# EAGLE design 8 Cell Balancing Module (EAGLE 5.12)
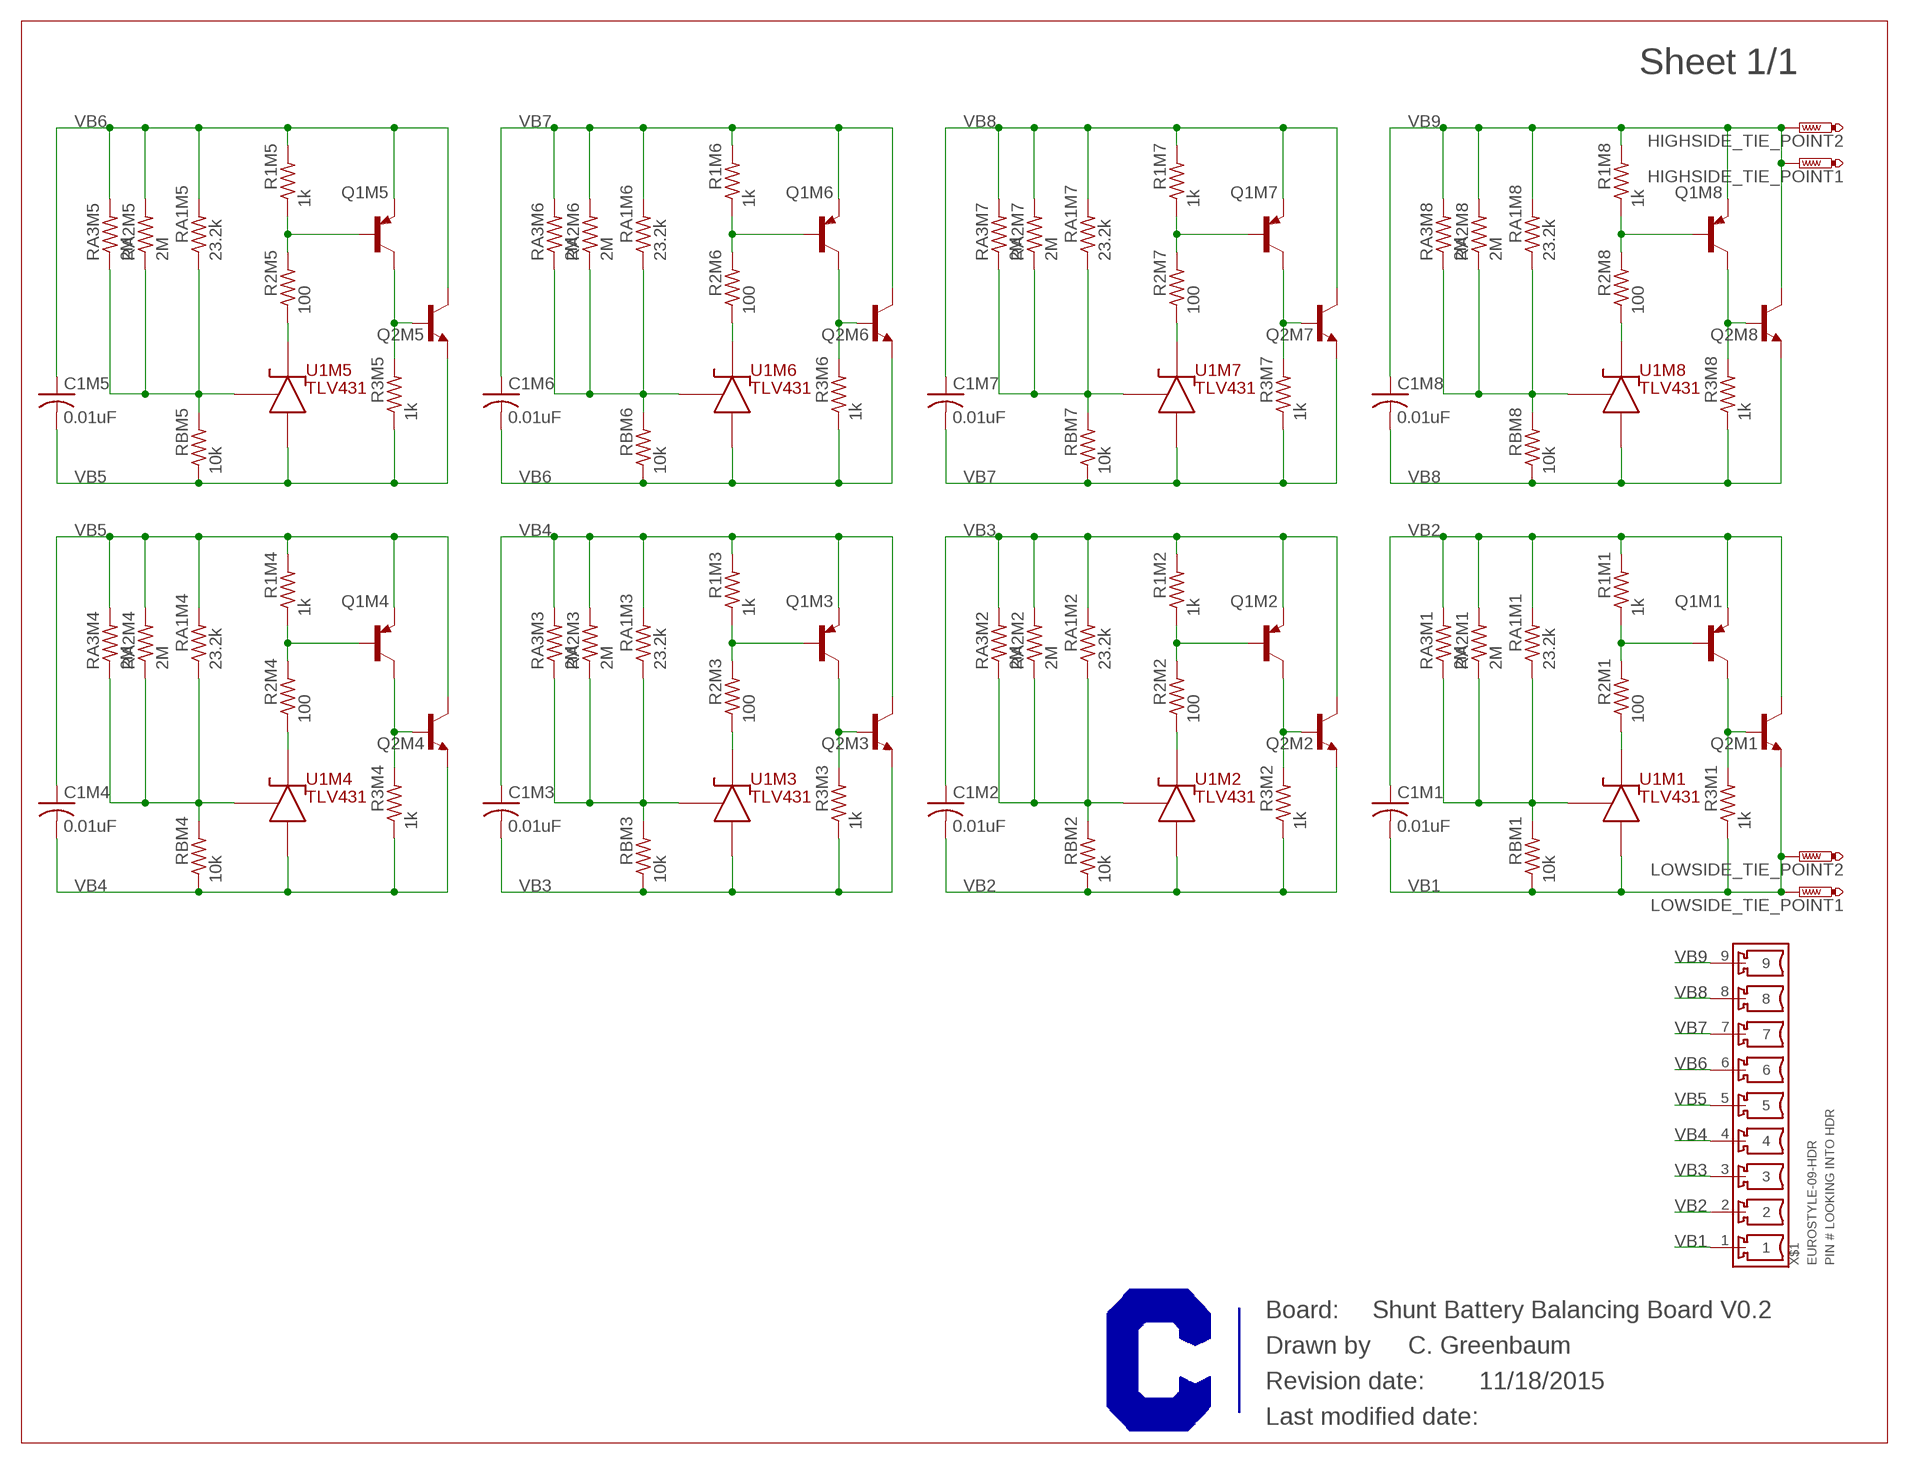
[diagram p0: schematic, sheet 1]

## Parts
C1M1  0.01uF  C-USC0603  [C0603]
C1M2  0.01uF  C-USC0603  [C0603]
C1M3  0.01uF  C-USC0603  [C0603]
C1M4  0.01uF  C-USC0603  [C0603]
C1M5  0.01uF  C-USC0603  [C0603]
C1M6  0.01uF  C-USC0603  [C0603]
C1M7  0.01uF  C-USC0603  [C0603]
C1M8  0.01uF  C-USC0603  [C0603]
HIGHSIDE_TIE_POINT1  PTR1PAD1-20Y  [P1-20Y]
HIGHSIDE_TIE_POINT2  PTR1PAD1-20Y  [P1-20Y]
LOWSIDE_TIE_POINT1  PTR1PAD1-20Y  [P1-20Y]
LOWSIDE_TIE_POINT2  PTR1PAD1-20Y  [P1-20Y]
Q1M1  MMBT3906LT1SMD  [SOT23-BEC]
Q1M2  MMBT3906LT1SMD  [SOT23-BEC]
Q1M3  MMBT3906LT1SMD  [SOT23-BEC]
Q1M4  MMBT3906LT1SMD  [SOT23-BEC]
Q1M5  MMBT3906LT1SMD  [SOT23-BEC]
Q1M6  MMBT3906LT1SMD  [SOT23-BEC]
Q1M7  MMBT3906LT1SMD  [SOT23-BEC]
Q1M8  MMBT3906LT1SMD  [SOT23-BEC]
Q2M1  D44VH10  -NPN-TO220V  [TO220V]
Q2M2  D44VH10  -NPN-TO220V  [TO220V]
Q2M3  D44VH10  -NPN-TO220V  [TO220V]
Q2M4  D44VH10  -NPN-TO220V  [TO220V]
Q2M5  D44VH10  -NPN-TO220V  [TO220V]
Q2M6  D44VH10  -NPN-TO220V  [TO220V]
Q2M7  D44VH10  -NPN-TO220V  [TO220V]
Q2M8  D44VH10  -NPN-TO220V  [TO220V]
R1M1  1k  R-US_R0603  [R0603]
R1M2  1k  R-US_R0603  [R0603]
R1M3  1k  R-US_R0603  [R0603]
R1M4  1k  R-US_R0603  [R0603]
R1M5  1k  R-US_R0603  [R0603]
R1M6  1k  R-US_R0603  [R0603]
R1M7  1k  R-US_R0603  [R0603]
R1M8  1k  R-US_R0603  [R0603]
R2M1  100  R-US_R0603  [R0603]
R2M2  100  R-US_R0603  [R0603]
R2M3  100  R-US_R0603  [R0603]
R2M4  100  R-US_R0603  [R0603]
R2M5  100  R-US_R0603  [R0603]
R2M6  100  R-US_R0603  [R0603]
R2M7  100  R-US_R0603  [R0603]
R2M8  100  R-US_R0603  [R0603]
R3M1  1k  R-US_R0603  [R0603]
R3M2  1k  R-US_R0603  [R0603]
R3M3  1k  R-US_R0603  [R0603]
R3M4  1k  R-US_R0603  [R0603]
R3M5  1k  R-US_R0603  [R0603]
R3M6  1k  R-US_R0603  [R0603]
R3M7  1k  R-US_R0603  [R0603]
R3M8  1k  R-US_R0603  [R0603]
RA1M1  23.2k  R-US_R0603  [R0603]
RA1M2  23.2k  R-US_R0603  [R0603]
RA1M3  23.2k  R-US_R0603  [R0603]
RA1M4  23.2k  R-US_R0603  [R0603]
RA1M5  23.2k  R-US_R0603  [R0603]
RA1M6  23.2k  R-US_R0603  [R0603]
RA1M7  23.2k  R-US_R0603  [R0603]
RA1M8  23.2k  R-US_R0603  [R0603]
RA2M1  2M  R-US_R0603  [R0603]
RA2M2  2M  R-US_R0603  [R0603]
RA2M3  2M  R-US_R0603  [R0603]
RA2M4  2M  R-US_R0603  [R0603]
RA2M5  2M  R-US_R0603  [R0603]
RA2M6  2M  R-US_R0603  [R0603]
RA2M7  2M  R-US_R0603  [R0603]
RA2M8  2M  R-US_R0603  [R0603]
RA3M1  2M  R-US_R0603  [R0603]
RA3M2  2M  R-US_R0603  [R0603]
RA3M3  2M  R-US_R0603  [R0603]
RA3M4  2M  R-US_R0603  [R0603]
RA3M5  2M  R-US_R0603  [R0603]
RA3M6  2M  R-US_R0603  [R0603]
RA3M7  2M  R-US_R0603  [R0603]
RA3M8  2M  R-US_R0603  [R0603]
RBM1  10k  R-US_R0603  [R0603]
RBM2  10k  R-US_R0603  [R0603]
RBM3  10k  R-US_R0603  [R0603]
RBM4  10k  R-US_R0603  [R0603]
RBM5  10k  R-US_R0603  [R0603]
RBM6  10k  R-US_R0603  [R0603]
RBM7  10k  R-US_R0603  [R0603]
RBM8  10k  R-US_R0603  [R0603]
U1M1  TLV431  [SOT-23-5_(DBV-R-PDSO-G5)]
U1M2  TLV431  [SOT-23-5_(DBV-R-PDSO-G5)]
U1M3  TLV431  [SOT-23-5_(DBV-R-PDSO-G5)]
U1M4  TLV431  [SOT-23-5_(DBV-R-PDSO-G5)]
U1M5  TLV431  [SOT-23-5_(DBV-R-PDSO-G5)]
U1M6  TLV431  [SOT-23-5_(DBV-R-PDSO-G5)]
U1M7  TLV431  [SOT-23-5_(DBV-R-PDSO-G5)]
U1M8  TLV431  [SOT-23-5_(DBV-R-PDSO-G5)]
X$1  EUROSTYLE-09-HDR  [EUROSTYLE_HEADER-9CKT-RA]

## Nets
N$1: Q1M1.C Q2M1.1(B) R3M1.2
N$2: Q1M1.B R1M1.1 R2M1.2
N$3: R2M2.1 U1M2.3(P$1.CATHODE)
N$4: RA1M1.1 RA2M1.1 RA3M1.1 RBM1.2 U1M1.4(P$2.REF)
N$5: Q1M2.C Q2M2.1(B) R3M2.2
N$6: Q1M2.B R1M2.1 R2M2.2
N$7: RA1M2.1 RA2M2.1 RA3M2.1 RBM2.2 U1M2.4(P$2.REF)
N$8: R2M3.1 U1M3.3(P$1.CATHODE)
N$9: Q1M3.C Q2M3.1(B) R3M3.2
N$10: Q1M3.B R1M3.1 R2M3.2
N$11: RA1M3.1 RA2M3.1 RA3M3.1 RBM3.2 U1M3.4(P$2.REF)
N$12: R2M4.1 U1M4.3(P$1.CATHODE)
N$13: Q1M4.C Q2M4.1(B) R3M4.2
N$14: Q1M4.B R1M4.1 R2M4.2
N$15: RA1M4.1 RA2M4.1 RA3M4.1 RBM4.2 U1M4.4(P$2.REF)
N$16: R2M5.1 U1M5.3(P$1.CATHODE)
N$17: Q1M5.C Q2M5.1(B) R3M5.2
N$18: Q1M5.B R1M5.1 R2M5.2
N$19: RA1M5.1 RA2M5.1 RA3M5.1 RBM5.2 U1M5.4(P$2.REF)
N$20: R2M6.1 U1M6.3(P$1.CATHODE)
N$21: Q1M6.C Q2M6.1(B) R3M6.2
N$22: Q1M6.B R1M6.1 R2M6.2
N$23: RA1M6.1 RA2M6.1 RA3M6.1 RBM6.2 U1M6.4(P$2.REF)
N$24: R2M7.1 U1M7.3(P$1.CATHODE)
N$25: Q1M7.C Q2M7.1(B) R3M7.2
N$26: Q1M7.B R1M7.1 R2M7.2
N$27: RA1M7.1 RA2M7.1 RA3M7.1 RBM7.2 U1M7.4(P$2.REF)
N$28: R2M8.1 U1M8.3(P$1.CATHODE)
N$29: Q1M8.C Q2M8.1(B) R3M8.2
N$30: Q1M8.B R1M8.1 R2M8.2
N$31: RA1M8.1 RA2M8.1 RA3M8.1 RBM8.2 U1M8.4(P$2.REF)
N$56: R2M1.1 U1M1.3(P$1.CATHODE)
VB1: C1M1.2 LOWSIDE_TIE_POINT1.TP LOWSIDE_TIE_POINT2.TP Q2M1.3(E) R3M1.1 RBM1.1 U1M1.5(P$3.ANODE) X$1.1
VB2: C1M1.1 C1M2.2 Q1M1.E Q2M1.2(C) Q2M2.3(E) R1M1.2 R3M2.1 RA1M1.2 RA2M1.2 RA3M1.2 RBM2.1 U1M2.5(P$3.ANODE) X$1.2
VB3: C1M2.1 C1M3.2 Q1M2.E Q2M2.2(C) Q2M3.3(E) R1M2.2 R3M3.1 RA1M2.2 RA2M2.2 RA3M2.2 RBM3.1 U1M3.5(P$3.ANODE) X$1.3
VB4: C1M3.1 C1M4.2 Q1M3.E Q2M3.2(C) Q2M4.3(E) R1M3.2 R3M4.1 RA1M3.2 RA2M3.2 RA3M3.2 RBM4.1 U1M4.5(P$3.ANODE) X$1.4
VB5: C1M4.1 C1M5.2 Q1M4.E Q2M4.2(C) Q2M5.3(E) R1M4.2 R3M5.1 RA1M4.2 RA2M4.2 RA3M4.2 RBM5.1 U1M5.5(P$3.ANODE) X$1.5
VB6: C1M5.1 C1M6.2 Q1M5.E Q2M5.2(C) Q2M6.3(E) R1M5.2 R3M6.1 RA1M5.2 RA2M5.2 RA3M5.2 RBM6.1 U1M6.5(P$3.ANODE) X$1.6
VB7: C1M6.1 C1M7.2 Q1M6.E Q2M6.2(C) Q2M7.3(E) R1M6.2 R3M7.1 RA1M6.2 RA2M6.2 RA3M6.2 RBM7.1 U1M7.5(P$3.ANODE) X$1.7
VB8: C1M7.1 C1M8.2 Q1M7.E Q2M7.2(C) Q2M8.3(E) R1M7.2 R3M8.1 RA1M7.2 RA2M7.2 RA3M7.2 RBM8.1 U1M8.5(P$3.ANODE) X$1.8
VB9: C1M8.1 HIGHSIDE_TIE_POINT1.TP HIGHSIDE_TIE_POINT2.TP Q1M8.E Q2M8.2(C) R1M8.2 RA1M8.2 RA2M8.2 RA3M8.2 X$1.9

## Notes on the sheet
- Shunt Battery Balancing Board V0.2
- C. Greenbaum
- 11/18/2015

## Library data of the parts
C1M1-C1M8 = resistor:C-US: CAPACITOR, American symbol
HIGHSIDE_TIE_POINT1 HIGHSIDE_TIE_POINT2 LOWSIDE_TIE_POINT1 LOWSIDE_TIE_POINT2 = testpad:PTR1: TEST PIN
Q1M1-Q1M8 = transistor-pnp:MMBT3906*: PNP Transistror
Q2M1-Q2M8 = transistor:*-NPN-: NPN Transistror BF959 corrected 2008.03.06
R1M1-R1M8 R2M1-R2M8 R3M1-R3M8 RA1M1-RA1M8 RA2M1-RA2M8 RA3M1-RA3M8 RBM1-RBM8 = resistor:R-US_: RESISTOR, American symbol
U1M1-U1M8 = TI:TLV431: TLV431 Low-Voltage Adjustable Precision Shunt Regulator
X$1 = Molex:EUROSTYLE-09-HDR: Eurostyle (tm) 3.50mm Pitch PCB Header, 9 Circuits This is the pluggable screw terminal block that Molex makes (like on the BQ76PL536 EVM boards). Molex series number: 39502 (horizontal header), 39501 (vertical header) Mates with: 39500 horizontal plug, 39503 vertical plug Website (horizontal header): http://www.molex.com/molex/products/datasheet.jsp?part=active/0395021009_TERMINAL_BLOCKS.xml Website (vertical header): http://www.molex.com/molex/products/datasheet.jsp?part=active/0395011009_TERMINAL_BLOCKS.xml Datasheet: http://www.mouser.com/ds/2/276/0395021009_TERMINAL_BLOCKS-163866.pdf; PARTNO: 39502-1009

## Board
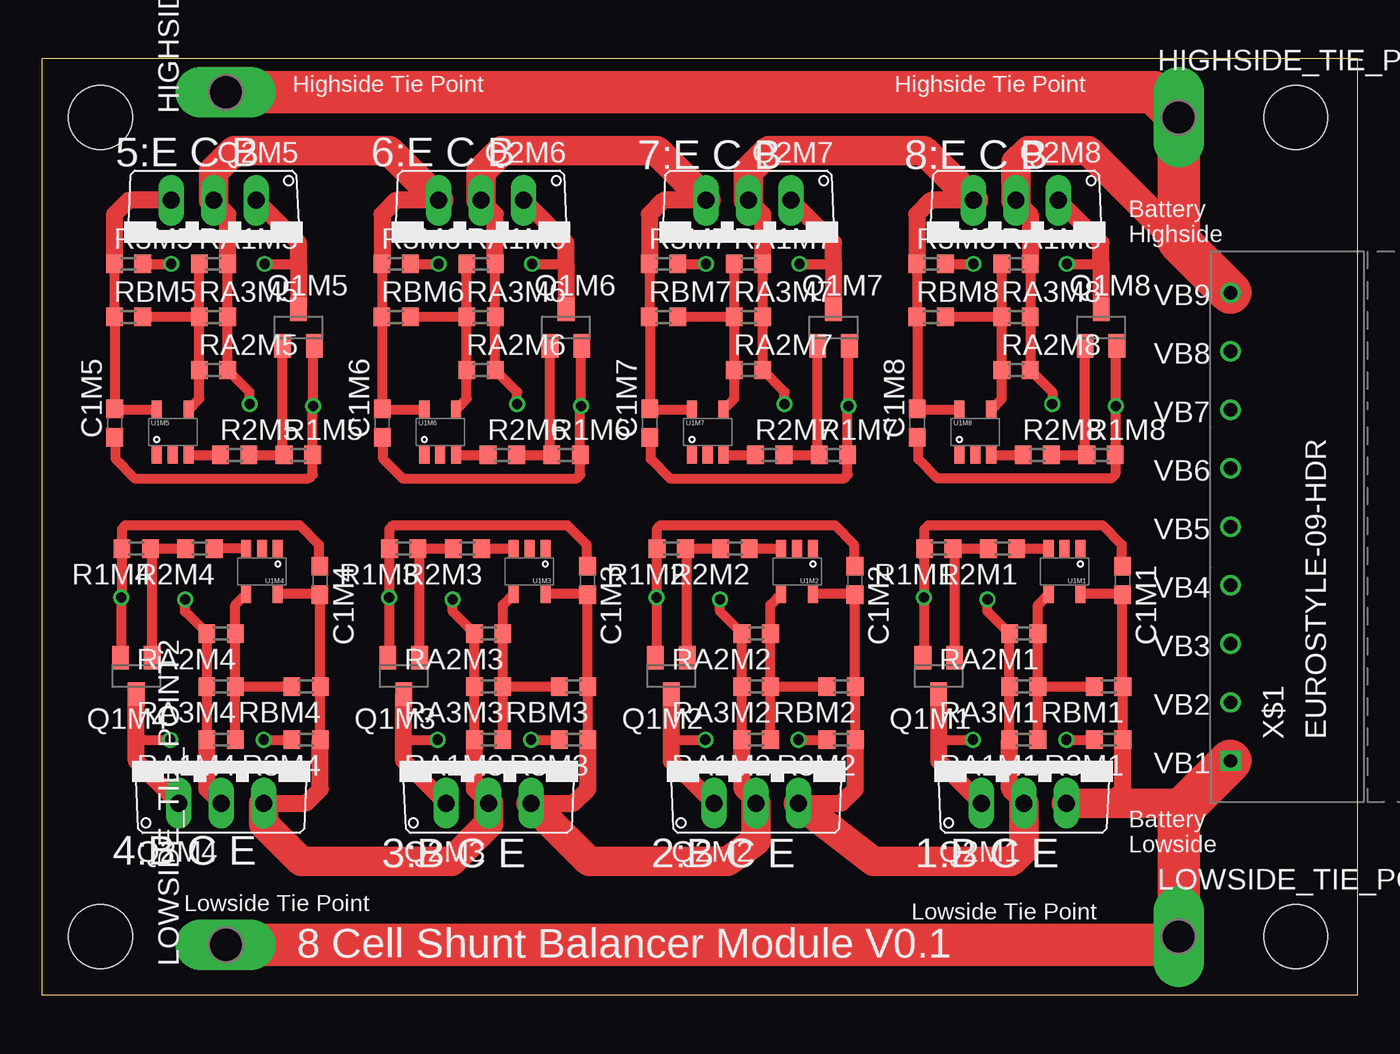
[diagram p1: board, top side]
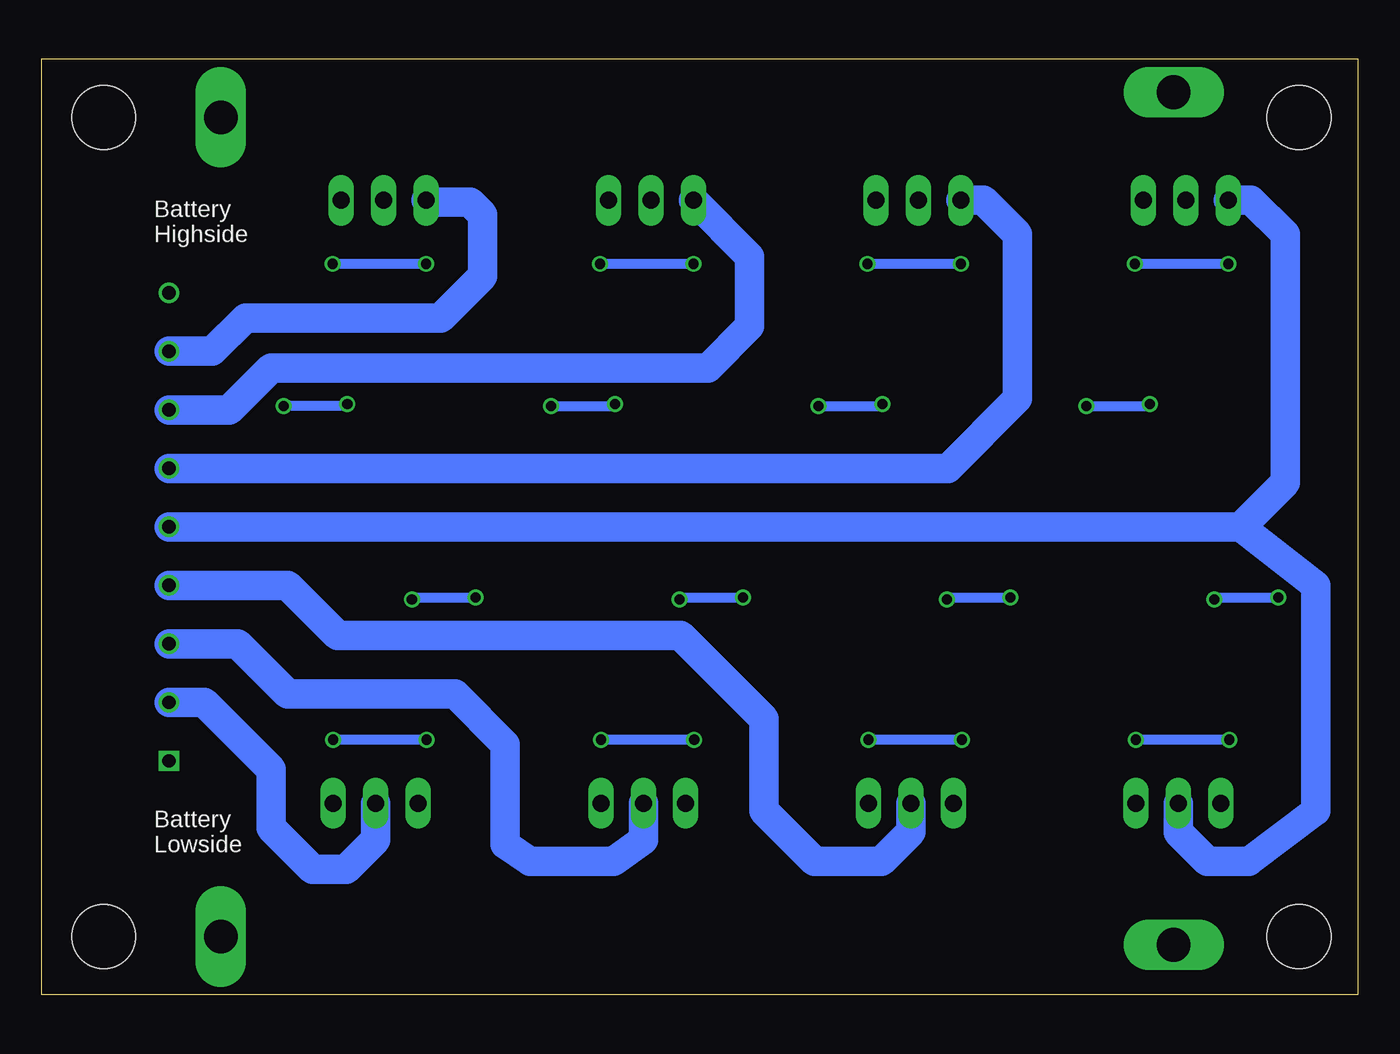
[diagram p2: board, bottom side, seen from below]

Size 78.7 x 56 mm. Coordinates in mm from the lower left corner, seen from the top.
Outline: 0,0 78.7,0 78.7,56 0,56 0,0
Copper layers (1*16): Top 0.0356mm / dielectric 1.5011mm / Bottom 0.0356mm
Design rules "OSH Park 2-layer": minimum track width 6mil, minimum drill 13mil, track to track 6mil, track to pad 6mil, pad to pad 6mil, via to via 6mil, smd to smd 6mil, copper to edge 15mil, drill to drill 6mil, minimum pad ring 7mil, minimum via ring 7mil, stop-mask expansion 4mil, vias tented up to drill 25mil, thermal gap 10mil
Holes 3.81 mm at 3.5,3.5 75,3.5 75,52.5 3.5,52.5
tKeepout: area 0.3,49.3 to 6.7,55.7; area 71.8,49.3 to 78.2,55.7; area 71.8,0.3 to 78.2,6.7; area 0.3,0.3 to 6.7,6.7
bKeepout: area 0.3,49.3 to 6.7,55.7; area 0.3,0.3 to 6.7,6.7; area 71.8,0.3 to 78.2,6.7; area 71.8,49.3 to 78.2,55.7

### Footprints (pad centres in the part's own frame; a part is rotated, then mirrored left to right if it is on the bottom)
C0603 = smd 1.1 x 1: 1 -0.85,0; 2 0.85,0
P1-20Y = drill 2.007 pad 2.54 long: TP 0,0
SOT23-BEC = smd 1 x 1.4: B -0.95,-1.1; C 0,1.1; E 0.95,-1.1
TO220V = drill 1.016 long: 1 -2.54,-2.54; 2 0,-2.54; 3 2.54,-2.54
R0603 = smd 1 x 1.1: 1 -0.85,0; 2 0.85,0
SOT-23-5_(DBV-R-PDSO-G5) = smd 0.6 x 1.05: 1 -0.95,-1.35; 2 0,-1.35; 3 0.95,-1.35; 4 0.95,1.35; 5 -0.95,1.35
EUROSTYLE_HEADER-9CKT-RA = drill 0.8 pad 1.22 square: 1 -14,7 | drill 0.8 pad 1.22 round: 2 -10.5,7; 3 -7,7; 4 -3.5,7; 5 0,7; 6 3.5,7; 7 7,7; 8 10.5,7; 9 14,7

### Placement (x,y rotation side)
C1M1  64.64,24.8 270 top
C1M2  48.64,24.8 270 top
C1M3  32.64,24.8 270 top
C1M4  16.64,24.8 270 top
C1M5  4.36,34.2 90 top
C1M6  20.36,34.2 90 top
C1M7  36.36,34.2 90 top
C1M8  52.36,34.2 90 top
HIGHSIDE_TIE_POINT1  68,52.5 0 top
HIGHSIDE_TIE_POINT2  11,54 90 top
LOWSIDE_TIE_POINT1  68,3.5 0 top
LOWSIDE_TIE_POINT2  11,3 90 top
Q1M1  53.65,19.08 180 top
Q1M2  37.65,19.08 180 top
Q1M3  21.65,19.08 180 top
Q1M4  5.65,19.08 180 top
Q1M5  15.35,39.92 0 top
Q1M6  31.35,39.92 0 top
Q1M7  47.35,39.92 0 top
Q1M8  63.35,39.92 0 top
Q2M1  58.73,14 0 top
Q2M2  42.73,14 0 top
Q2M3  26.73,14 0 top
Q2M4  10.73,14 0 top
Q2M5  10.27,45 180 top
Q2M6  26.27,45 180 top
Q2M7  42.27,45 180 top
Q2M8  58.27,45 180 top
R1M1  53.65,26.7 180 top
R1M2  37.65,26.7 180 top
R1M3  21.65,26.7 180 top
R1M4  5.65,26.7 180 top
R1M5  15.35,32.3 0 top
R1M6  31.35,32.3 0 top
R1M7  47.35,32.3 0 top
R1M8  63.35,32.3 0 top
R2M1  57.46,26.7 180 top
R2M2  41.46,26.7 180 top
R2M3  25.46,26.7 180 top
R2M4  9.46,26.7 180 top
R2M5  11.54,32.3 0 top
R2M6  27.54,32.3 0 top
R2M7  43.54,32.3 0 top
R2M8  59.54,32.3 0 top
R3M1  63.81,15.27 180 top
R3M2  47.81,15.27 180 top
R3M3  31.81,15.27 180 top
R3M4  15.81,15.27 180 top
R3M5  5.19,43.73 0 top
R3M6  21.19,43.73 0 top
R3M7  37.19,43.73 0 top
R3M8  53.19,43.73 0 top
RA1M1  58.73,15.27 180 top
RA1M2  42.73,15.27 180 top
RA1M3  26.73,15.27 180 top
RA1M4  10.73,15.27 180 top
RA1M5  10.27,43.73 0 top
RA1M6  26.27,43.73 0 top
RA1M7  42.27,43.73 0 top
RA1M8  58.27,43.73 0 top
RA2M1  58.73,21.62 180 top
RA2M2  42.73,21.62 180 top
RA2M3  26.73,21.62 180 top
RA2M4  10.73,21.62 180 top
RA2M5  10.27,37.38 0 top
RA2M6  26.27,37.38 0 top
RA2M7  42.27,37.38 0 top
RA2M8  58.27,37.38 0 top
RA3M1  58.73,18.45 180 top
RA3M2  42.73,18.45 180 top
RA3M3  26.73,18.45 180 top
RA3M4  10.73,18.45 180 top
RA3M5  10.27,40.55 0 top
RA3M6  26.27,40.55 0 top
RA3M7  42.27,40.55 0 top
RA3M8  58.27,40.55 0 top
RBM1  63.81,18.45 180 top
RBM2  47.81,18.45 180 top
RBM3  31.81,18.45 180 top
RBM4  15.81,18.45 180 top
RBM5  5.19,40.55 0 top
RBM6  21.19,40.55 0 top
RBM7  37.19,40.55 0 top
RBM8  53.19,40.55 0 top
U1M1  61.17,25.33 180 top
U1M2  45.17,25.33 180 top
U1M3  29.17,25.33 180 top
U1M4  13.17,25.33 180 top
U1M5  7.83,33.67 0 top
U1M6  23.83,33.67 0 top
U1M7  39.83,33.67 0 top
U1M8  55.83,33.67 0 top
X$1  78.09,28 90 top

### Tracks (layer width: path | path; a pad name or v marks a point on that pad's centre or on a via)
N$1  (via drill 0.6)
  Top 0.61: v61.27,15.27 R3M1.2 | 53.65,15.27 v55.68,15.27
  Top 1.016: Q2M1.1 53.65,14 53.65,15.27 Q1M1.C
  Bottom 0.61: v55.68,15.27 v61.27,15.27
N$2
  Top 0.61: R2M1.2 R1M1.1 54.6,26.6 Q1M1.B
N$3
  Top 0.61: U1M2.3 44.2,26.7 R2M2.1
N$4
  Top 0.61: RA1M1.1 RA3M1.1 | RA3M1.1 RA2M1.1 59.58,23.34 U1M1.4 | RA3M1.1 RBM1.2
N$5  (via drill 0.6)
  Top 0.61: v45.27,15.27 R3M2.2 | 37.65,15.27 v39.68,15.27
  Top 1.016: Q2M2.1 37.65,14 37.65,15.27 Q1M2.C
  Bottom 0.61: v39.68,15.27 v45.27,15.27
N$6
  Top 0.61: R2M2.2 R1M2.1 38.6,26.6 Q1M2.B
N$7
  Top 0.61: RA1M2.1 RA3M2.1 | RA3M2.1 RA2M2.1 43.58,23.34 U1M2.4 | RA3M2.1 RBM2.2
N$8
  Top 0.61: U1M3.3 28.2,26.7 R2M3.1
N$9  (via drill 0.6)
  Top 0.61: v29.27,15.27 R3M3.2 | 21.65,15.27 v23.68,15.27
  Top 1.016: Q2M3.1 21.65,14 21.65,15.27 Q1M3.C
  Bottom 0.61: v23.68,15.27 v29.27,15.27
N$10
  Top 0.61: R2M3.2 R1M3.1 22.6,26.6 Q1M3.B
N$11
  Top 0.61: RA1M3.1 RA3M3.1 | RA3M3.1 RA2M3.1 27.58,23.34 U1M3.4 | RA3M3.1 RBM3.2
N$12
  Top 0.61: U1M4.3 12.2,26.7 R2M4.1
N$13  (via drill 0.6)
  Top 0.61: v13.27,15.27 R3M4.2 | 5.65,15.27 v7.68,15.27
  Top 1.016: Q2M4.1 5.65,14 5.65,15.27 Q1M4.C
  Bottom 0.61: v7.68,15.27 v13.27,15.27
N$14
  Top 0.61: R2M4.2 R1M4.1 6.6,26.6 Q1M4.B
N$15
  Top 0.61: RA1M4.1 RA3M4.1 | RA3M4.1 RA2M4.1 11.58,23.34 U1M4.4 | RA3M4.1 RBM4.2
N$16
  Top 0.61: U1M5.3 8.8,32.3 R2M5.1
N$17  (via drill 0.6)
  Top 0.61: R3M5.2 v7.73,43.73 | v13.32,43.73 15.35,43.73
  Top 1.016: Q2M5.1 15.35,45 15.35,43.73 Q1M5.C
  Bottom 0.61: v7.73,43.73 v13.32,43.73
N$18
  Top 0.61: R2M5.2 R1M5.1 14.4,32.4 Q1M5.B
N$19
  Top 0.61: RA3M5.1 RA1M5.1 | RA3M5.1 RA2M5.1 9.42,35.66 U1M5.4 | RA3M5.1 RBM5.2
N$20
  Top 0.61: U1M6.3 24.8,32.3 R2M6.1
N$21  (via drill 0.6)
  Top 0.61: R3M6.2 v23.73,43.73 | v29.32,43.73 31.35,43.73
  Top 1.016: Q2M6.1 31.35,45 31.35,43.73 Q1M6.C
  Bottom 0.61: v23.73,43.73 v29.32,43.73
N$22
  Top 0.61: R2M6.2 R1M6.1 30.4,32.4 Q1M6.B
N$23
  Top 0.61: RA3M6.1 RA1M6.1 | RA3M6.1 RA2M6.1 25.42,35.66 U1M6.4 | RA3M6.1 RBM6.2
N$24
  Top 0.61: U1M7.3 40.8,32.3 R2M7.1
N$25  (via drill 0.6)
  Top 0.61: R3M7.2 v39.73,43.73 | v45.32,43.73 47.35,43.73
  Top 1.016: Q2M7.1 47.35,45 47.35,43.73 Q1M7.C
  Bottom 0.61: v39.73,43.73 v45.32,43.73
N$26
  Top 0.61: R2M7.2 R1M7.1 46.4,32.4 Q1M7.B
N$27
  Top 0.61: RA3M7.1 RA1M7.1 | RA3M7.1 RA2M7.1 41.42,35.66 U1M7.4 | RA3M7.1 RBM7.2
N$28
  Top 0.61: U1M8.3 56.8,32.3 R2M8.1
N$29  (via drill 0.6)
  Top 0.61: R3M8.2 v55.73,43.73 | v61.32,43.73 63.35,43.73
  Top 1.016: Q2M8.1 63.35,45 63.35,43.73 Q1M8.C
  Bottom 0.61: v55.73,43.73 v61.32,43.73
N$30
  Top 0.61: R2M8.2 R1M8.1 62.4,32.4 Q1M8.B
N$31
  Top 0.61: RA3M8.1 RA1M8.1 | RA3M8.1 RA2M8.1 57.42,35.66 U1M8.4 | RA3M8.1 RBM8.2
N$56
  Top 0.61: U1M1.3 60.2,26.7 R2M1.1
VB1
  Top 0.61: R3M1.1 RBM1.1 64.64,18.47 C1M1.2 64.6,23.98 U1M1.5
  Top 1.016: Q2M1.3 63.81,11.46 64.66,12.31 R3M1.1
  Top 1.778: X$1.1 68.55,11.46 Q2M1.3
  Top 2.54: LOWSIDE_TIE_POINT2.TP 67.5,3 LOWSIDE_TIE_POINT1.TP 68,10.91 X$1.1
VB2  (via drill 0.6)
  Top 0.61: RA1M1.2 RA3M1.2 RA2M1.2 56.57,22.93 v56.57,23.65 | R1M1.2 52.8,26.99 | C1M1.1 64.57,25.71 64.57,26.95 63.43,28.1 53.02,28.1 52.8,27.88 R1M1.2 | R1M1.2 52.8,23.82 v52.76,23.78 52.76,20.24 Q1M1.E | R3M2.1 RBM2.1 48.64,18.47 C1M2.2 48.6,23.98 U1M2.5
  Top 1.016: Q2M1.2 57.88,12.31 RA1M1.2 | Q2M2.3 47.81,11.46 48.66,12.31 R3M2.1
  Top 1.778: Q2M2.3 49.73,8 58,8 58.73,8.73 Q2M1.2
  Bottom 0.61: v56.57,23.65 56.44,23.78 v52.76,23.78
  Bottom 1.778: X$1.2 69,17.5 65,13.5 65,10 62.5,7.5 60.5,7.5 58.73,9.27 Q2M1.2
VB3  (via drill 0.6)
  Top 0.61: R3M3.1 RBM3.1 32.64,18.47 C1M3.2 32.6,23.98 U1M3.5 | RA1M2.2 RA3M2.2 RA2M2.2 40.57,22.93 v40.57,23.65 | R1M2.2 36.8,26.99 | C1M2.1 48.57,25.71 48.57,26.95 47.43,28.1 37.02,28.1 36.8,27.88 R1M2.2 | R1M2.2 36.8,23.82 v36.76,23.78 36.76,20.24 Q1M2.E
  Top 1.016: Q2M3.3 31.81,11.46 32.66,12.31 R3M3.1 | Q2M2.2 41.88,12.31 RA1M2.2
  Top 1.778: Q2M3.3 32.73,8 41,8 42.73,9.23 Q2M2.2
  Bottom 0.61: v40.57,23.65 40.44,23.78 v36.76,23.78
  Bottom 1.778: X$1.3 67,21 64,18 54,18 51,15 51,9 49.5,8 44.5,8 42.73,9.27 Q2M2.2
VB4  (via drill 0.6)
  Top 0.61: RA1M3.2 RA3M3.2 RA2M3.2 24.57,22.93 v24.57,23.65 | R1M3.2 20.8,26.99 | C1M3.1 32.57,25.71 32.57,26.95 31.43,28.1 21.02,28.1 20.8,27.88 R1M3.2 | R1M3.2 20.8,23.82 v20.76,23.78 20.76,20.24 Q1M3.E | R3M4.1 RBM4.1 16.64,18.47 C1M4.2 16.6,23.98 U1M4.5
  Top 1.016: Q2M3.2 25.88,12.31 RA1M3.2 | Q2M4.3 15.81,11.46 16.66,12.31 R3M4.1
  Top 1.778: Q2M3.2 26.73,10.23 24.5,8 15.5,8 13.27,10.23 Q2M4.3
  Bottom 0.61: v24.57,23.65 24.44,23.78 v20.76,23.78
  Bottom 1.778: X$1.4 64,24.5 61,21.5 40.5,21.5 35.5,16.5 35.5,11 32.5,8 28.5,8 26.73,9.77 Q2M3.2
VB5  (via drill 0.6)
  Top 0.61: RA1M4.2 RA3M4.2 RA2M4.2 8.57,22.93 v8.57,23.65 | R1M4.2 4.8,26.99 | C1M4.1 16.57,25.71 16.57,26.95 15.43,28.1 5.01,28.1 4.8,27.88 R1M4.2 | R1M4.2 4.8,23.82 v4.76,23.78 4.76,20.24 Q1M4.E | R3M5.1 RBM5.1 4.36,40.53 C1M5.2 4.4,35.02 U1M5.5
  Top 1.016: Q2M4.2 9.88,12.31 RA1M4.2 | Q2M5.3 5.19,47.54 4.34,46.69 R3M5.1
  Bottom 0.61: v8.57,23.65 8.44,23.78 v4.76,23.78
  Bottom 1.778: 7,28 X$1.5 | 7,28 4.34,30.66 4.34,45.5 6.38,47.54 Q2M5.3 | 7,28 2.5,24.5 2.5,11 6.5,8 9,8 10.73,9.73 Q2M4.2
VB6  (via drill 0.6)
  Top 0.61: RA1M5.2 RA3M5.2 RA2M5.2 12.43,36.07 v12.43,35.35 | R1M5.2 16.2,32.01 | C1M5.1 4.43,33.29 4.43,32.05 5.57,30.9 15.98,30.9 16.2,31.12 R1M5.2 | R1M5.2 16.2,35.18 v16.24,35.22 16.24,38.76 Q1M5.E | R3M6.1 RBM6.1 20.36,40.53 C1M6.2 20.4,35.02 U1M6.5
  Top 1.016: Q2M5.2 11.12,46.69 RA1M5.2 | Q2M6.3 21.19,47.54 20.34,46.69 R3M6.1
  Top 1.778: Q2M6.3 20.77,50.5 11.5,50.5 10.27,49.27 Q2M5.2
  Bottom 0.61: v12.43,35.35 12.56,35.22 v16.24,35.22
  Bottom 1.778: X$1.6 24.5,31.5 20.34,35.66 20.34,45.5 22.38,47.54 Q2M6.3
VB7  (via drill 0.6)
  Top 0.61: RA1M6.2 RA3M6.2 RA2M6.2 28.43,36.07 v28.43,35.35 | R1M6.2 32.2,32.01 | C1M6.1 20.43,33.29 20.43,32.05 21.57,30.9 31.98,30.9 32.2,31.12 R1M6.2 | R1M6.2 32.2,35.18 v32.24,35.22 32.24,38.76 Q1M6.E | R3M7.1 RBM7.1 36.36,40.53 C1M7.2 36.4,35.02 U1M7.5
  Top 1.016: Q2M6.2 27.12,46.69 RA1M6.2 | Q2M7.3 37.19,47.54 36.34,46.69 R3M7.1
  Top 1.778: Q2M7.3 36.77,50.5 27.5,50.5 26.27,49.27 Q2M6.2
  Bottom 0.61: v28.43,35.35 28.56,35.22 v32.24,35.22
  Bottom 1.778: X$1.7 67.5,35 65,37.5 38.86,37.5 36.36,40 36.36,44.17 Q2M7.3
VB8  (via drill 0.6)
  Top 0.61: RA1M7.2 RA3M7.2 RA2M7.2 44.43,36.07 v44.43,35.35 | R1M7.2 48.2,32.01 | C1M7.1 36.43,33.29 36.43,32.05 37.57,30.9 47.98,30.9 48.2,31.12 R1M7.2 | R1M7.2 48.2,35.18 v48.24,35.22 48.24,38.76 Q1M7.E | R3M8.1 RBM8.1 52.36,40.53 C1M8.2 52.4,35.02 U1M8.5
  Top 1.016: Q2M7.2 43.12,46.69 RA1M7.2 | Q2M8.3 53.19,47.54 52.34,46.69 R3M8.1
  Top 1.778: Q2M8.3 52.77,50.5 43.5,50.5 42.27,49.27 Q2M7.2
  Bottom 0.61: v44.43,35.35 44.56,35.22 v48.24,35.22
  Bottom 1.778: X$1.8 68.5,38.5 66.5,40.5 54.84,40.5 52.34,43 52.34,46.69 53.08,47.42 55.62,47.42 Q2M8.3
VB9  (via drill 0.6)
  Top 0.61: RA1M8.2 RA3M8.2 RA2M8.2 60.43,36.07 v60.43,35.35 | R1M8.2 64.2,32.01 | C1M8.1 52.43,33.29 52.43,32.05 53.57,30.9 63.98,30.9 64.2,31.12 R1M8.2 | R1M8.2 64.2,35.18 v64.24,35.22 64.24,38.76 Q1M8.E
  Top 1.016: Q2M8.2 59.12,46.69 RA1M8.2
  Top 1.778: X$1.9 62.59,50.5 59,50.5 58.27,49.77 Q2M8.2
  Top 2.54: HIGHSIDE_TIE_POINT2.TP 66.5,54 HIGHSIDE_TIE_POINT1.TP 68,45.09 X$1.9
  Bottom 0.61: v60.43,35.35 60.56,35.22 v64.24,35.22

### Text on the board
tPlace: Highside Tie Point | Highside Tie Point | 5:E C B | 6:E C B | 7:E C B | 8:E C B | Battery | Highside | VB9 | VB8 | VB7 | VB6 | VB5 | VB4 | VB3 | VB2 | VB1 | Battery | 4:B C E | 3:B C E | 2:B C E | 1:B C E | Lowside | Lowside Tie Point | Lowside Tie Point | 8 Cell Shunt Balancer Module V0.1
bPlace: Battery | Highside | Battery | Lowside